# EAGLE design untitled (EAGLE 9.6.2)
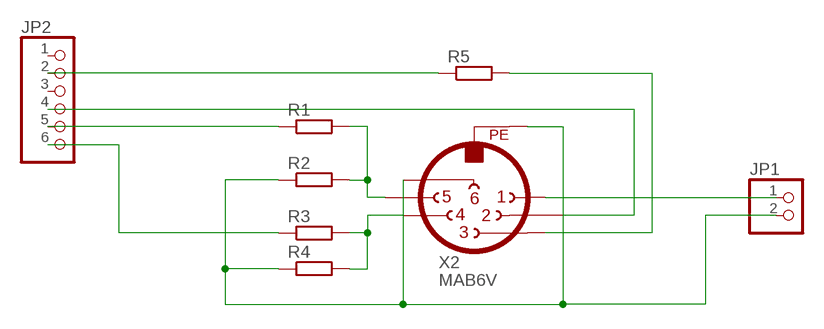
[diagram p0: schematic, sheet 1]

## Parts
JP1  PINHD-1X2  [1X02]
JP2  PINHD-1X6  [1X06]
R1  R-EU_0204/7  [0204/7]
R2  R-EU_0204/7  [0204/7]
R3  R-EU_0204/7  [0204/7]
R4  R-EU_0204/7  [0204/7]
R5  R-EU_0207/15  [0207/15]
X2  MAB6V  [MAB6V]

## Nets
GND: JP1.2 R2.1 R4.1 X2.6 X2.PE
N$1: R1.2 R2.2 X2.5
N$2: R3.2 R4.2 X2.4
N$3: R5.2 X2.3
N$5: JP2.5 R1.1
N$6: JP2.6 R3.1
N$7: JP2.4 X2.2
N$8: JP2.2 R5.1
N$9: JP1.1 X2.1
Unconnected: JP2.1 JP2.3

## Library data of the parts
JP1 = pinhead:PINHD-1X2: PIN HEADER
JP2 = pinhead:PINHD-1X6: PIN HEADER
R1-R5 = rcl:R-EU_: RESISTOR, European symbol; SPICEPREFIX: R
X2 = con-hirschmann:MAB6V: Female CONNECTOR 6 pins with shield, vertical (DIN 45322); OC_FARNELL: unknown; OC_NEWARK: unknown

## Net classes
0 default: width 1.27 mm, clearance 1.27 mm

## Board
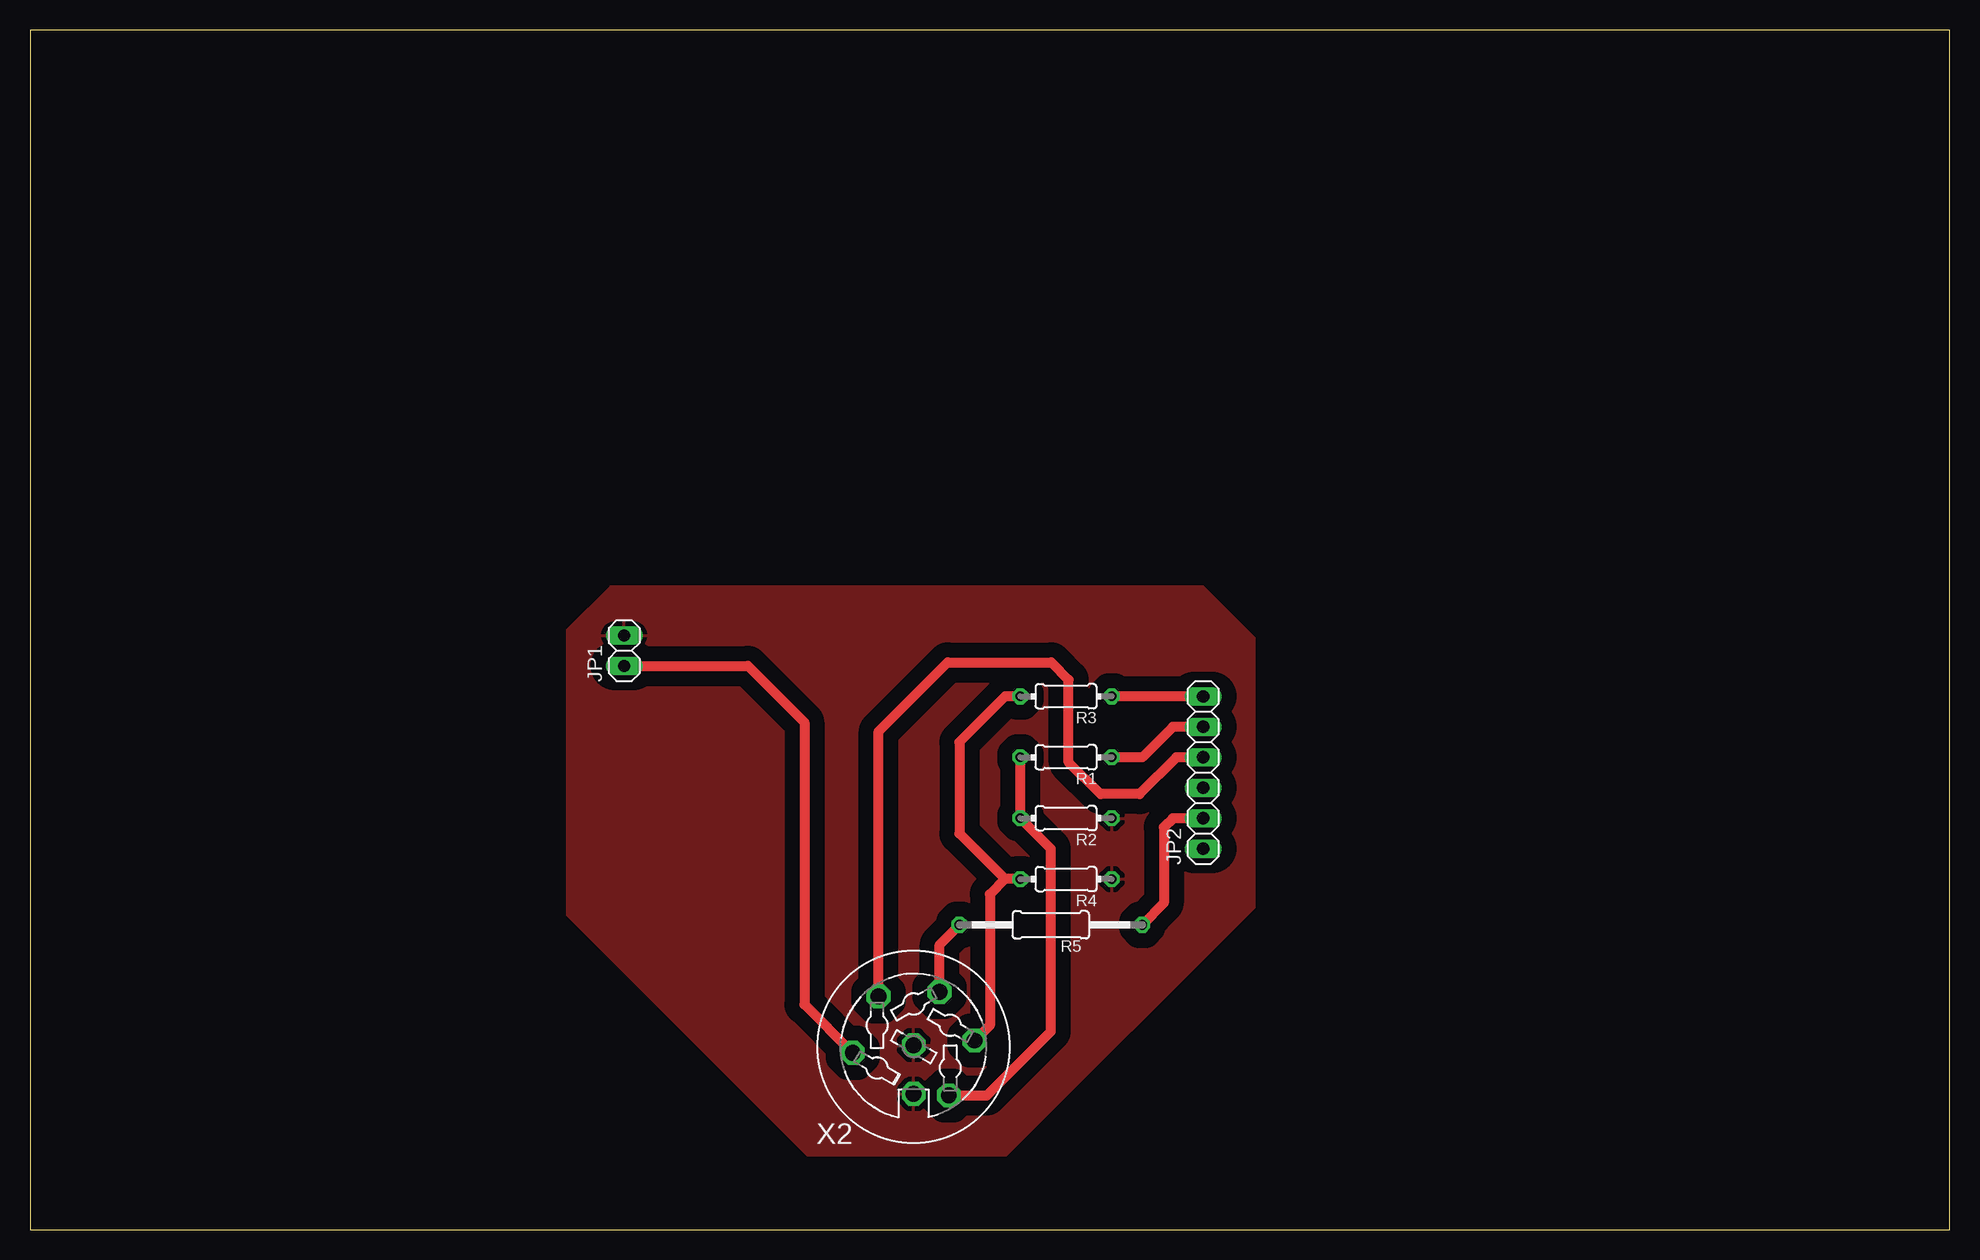
[diagram p1: board, top side]

Size 160 x 100 mm. Coordinates in mm from the lower left corner, seen from the top.
Outline: 0,0 160,0 160,100 0,100 0,0
Copper layers (1*16): Top 0.035mm / dielectric 1.5mm / Bottom 0.035mm
Design rules "fab": minimum track width 10mil, minimum drill 32mil, track to track 16mil, track to pad 16mil, pad to pad 16mil, via to via 16mil, smd to smd 6mil, copper to edge 16mil, drill to drill 16mil, minimum pad ring 10mil, minimum via ring 8mil, stop-mask expansion 4mil, vias tented up to drill 0mil, thermal gap 16mil

### Footprints (pad centres in the part's own frame; a part is rotated, then mirrored left to right if it is on the bottom)
1X02 = drill 1.016 long: 1 -1.27,0; 2 1.27,0
1X06 = drill 1.016 long: 1 -6.35,0; 2 -3.81,0; 3 -1.27,0; 4 1.27,0; 5 3.81,0; 6 6.35,0
0204/7 = drill 0.813 octagon: 1 -3.81,0; 2 3.81,0
0207/15 = drill 0.813 octagon: 1 -7.62,0; 2 7.62,0
MAB6V = drill 1.321 octagon: 1 5.08,0.508; 2 2.921,-4.191; 3 -2.159,-4.572; 4 -5.08,-0.508; 5 -2.921,4.064; 6 0,-0.127; PE 0,3.937

### Placement (x,y rotation side)
JP1  49.53,48.26 90 top
JP2  97.79,38.1 90 top
R1  86.36,39.37 180 top
R2  86.36,34.29 180 top
R3  86.36,44.45 180 top
R4  86.36,29.21 180 top
R5  85.09,25.4 180 top
X2  73.66,15.24 180 top

### Tracks (layer width: path | path; a pad name or v marks a point on that pad's centre or on a via)
GND
  pour Top: 44.74,49.96 44.74,26.22 64.79,6.17 81.39,6.17 102.09,26.87 102.09,49.32 97.8,53.61 48.39,53.61
N$1
  Top 0.813: R1.2 R2.2 85.08,31.76 85.08,16.5 79.76,11.18 X2.5
N$2
  Top 0.813: R3.2 81.28,44.45 77.47,40.64 77.47,33.02 81.28,29.21 | R4.2 81.28,29.21 | 81.28,29.21 80.01,27.94 80.01,17.02 X2.4
N$3
  Top 0.813: X2.3 75.82,23.75 R5.2
N$5
  Top 0.813: JP2.5 95.25,41.91 92.71,39.37 R1.1
N$6
  Top 0.813: JP2.6 R3.1
N$7
  Top 0.813: X2.2 70.74,41.53 76.49,47.28 85.13,47.28 86.58,45.83 86.58,38.95 89.23,36.3 92.49,36.3 95.56,39.37 JP2.4
N$8
  Top 0.813: JP2.2 95.26,34.29 94.52,33.55 94.52,27.21 R5.1
N$9
  Top 0.813: JP1.1 59.85,46.99 64.55,42.29 64.55,18.76 X2.1